# Altium schematic sheet Schematic Diagram.SchDoc
size A; SheetNumber: 2; SheetTotal: 2
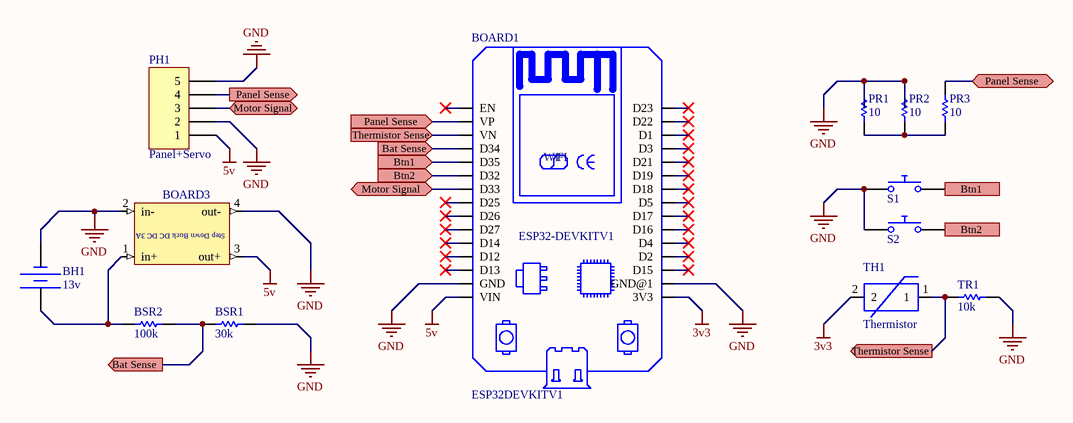
[diagram p0: Schematic Diagram.SchDoc]

## Parts
BH1  DC Magnitude: 13v  [HDR1X2]
BOARD1  ESP32DEVKITV1  [ESP32-DEVKITV1]
BOARD3  Step Down Buck DC DC 3A  [Step Down Buck DC DC 3A]  (value not drawn)
BSR1  value 30k  [Smd Resistor]  (hidden comment: Resistor_1)
BSR2  value 100k  [Smd Resistor]
PH1  Panel+Servo  [HDR1X5]
PR1  value 10  [1/4W SMD Resistor]
PR2  value 10  [1/4W SMD Resistor]
PR3  value 10  [1/4W SMD Resistor]
S1  Push Button Normally Opened  [Smd Push Button (Extended Legs)]  (value not drawn)
S2  Push Button Normally Opened  [Smd Push Button (Extended Legs)]  (value not drawn)
TH1  Thermistor  [Smd Thermistor Terminal]
TR1  value 10k  [Smd Resistor]  (hidden comment: Resistor_3)

## Ports
Bat Sense (in), Bat Sense (out), Btn1 (in), Btn1 (out), Btn2 (in), Btn2 (out), Motor Signal (bidir), Panel Sense (bidir), Panel Sense (in), Panel Sense (out), Thermistor Sense (in), Thermistor Sense (out)

## Nets
3v3: BOARD1.3V3 TH1.2
5v: BOARD1.VIN BOARD3.3(out+) PH1.1
GND: BH1.1(-) BOARD1.GND BOARD1.GND@1 BOARD3.2(in-) BOARD3.4(out-) BSR1.1 PH1.2 PH1.5 PR1.1 PR2.1 S1.1 S2.1 TR1.1
Bat Sense: BOARD1.D34 BSR1.2 BSR2.1 ; port Bat Sense
Btn1: BOARD1.D35 S1.2 ; port Btn1
Btn2: BOARD1.D32 S2.2 ; port Btn2
Motor Signal: BOARD1.D33 PH1.3 ; port Motor Signal
Panel Sense: BOARD1.VP PH1.4 PR3.1 ; port Panel Sense
Thermistor Sense: BOARD1.VN TH1.1 TR1.2 ; port Thermistor Sense
NetBH1_2: BH1.2(+) BOARD3.1(in+) BSR2.2
NetPR1_2: PR1.2 PR2.2 PR3.2

Not connected (* = marked no-connect by the designer): BOARD1 D1* D2* D3* D4* D5* D12* D13* D14* D15* D16* D17* D18* D19* D21* D22* D23* D25* D26* D27* EN*

## Notes on the sheet
- (in symbol ESP32DEVKITV1) WI; FI; ESP32-DEVKITV1

## Library data of the parts
BH1 = Battery: Constant Voltage Source; SimulationGenericComponent: True
BOARD1 = ESP32DEVKITV1: Dual core, Wi-Fi: 2.4 GHz up to 150 Mbits/s,BLE (Bluetooth Low Energy) and legacy Bluetooth, 32 bits, Up to 240 MHz; MF: Do it; SnapEDA_Link: https://www.snapeda.com/parts/ESP32%20DEVKIT%20V1/Do%20it/view-part/5659245/?ref=snap; Price: None; MP: ESP32 DEVKIT V1; Check_prices: https://www.snapeda.com/parts/ESP32%20DEVKIT%20V1/Do%20it/view-part/5659245/?ref=eda; Availability: Unavailable; Value: *; Package: Package
BSR1 = Resistor_1: Resistor; TC1: 0; SimulationGenericComponent: True; TC2: 0
BSR2 = Resistor_2: Resistor; TC1: 0; SimulationGenericComponent: True; TC2: 0
PH1 = Header 5: Header, 5-Pin; LatestRevisionDate: 17-Jul-2002; LatestRevisionNote: Re-released for DXP Platform.; Publisher: Altium Limited
PR1-PR3 = Resistor: TC1: 0; SimulationGenericComponent: True; TC2: 0
S1 S2 = Push Button NO: closed: 0; Rclosed: 1m; Ropen: 1Meg; SimulationGenericComponent: True
TR1 = Resistor_3: Resistor; TC1: 0; SimulationGenericComponent: True; TC2: 0